# EAGLE design SNES-logo-base (EAGLE 7.2.0)
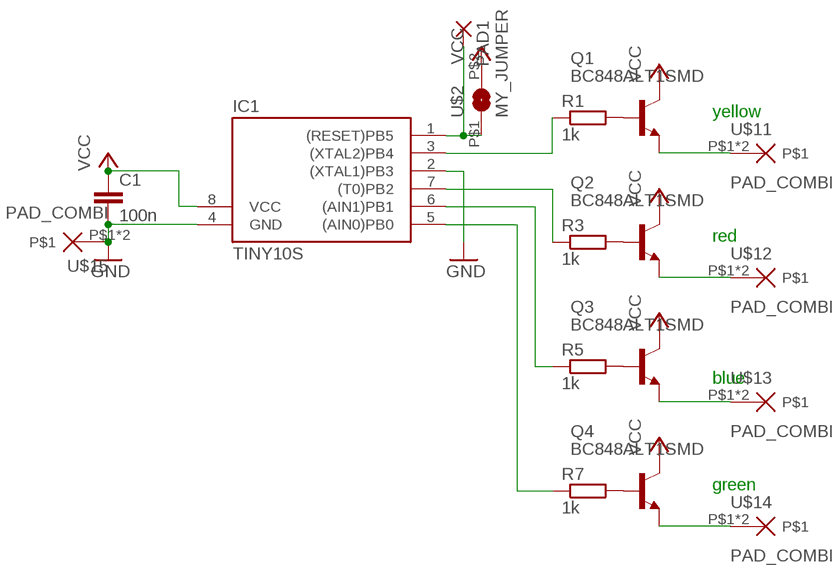
[diagram p0: schematic, sheet 1]

## Parts
C1  100n  C0805  [Z0805]
IC1  TINY10S  [SOIC8]
PAD1  SMD2  [SMD1,27-2,54]
Q1  BC848ALT1SMD  [SOT23]
Q2  BC848ALT1SMD  [SOT23]
Q3  BC848ALT1SMD  [SOT23]
Q4  BC848ALT1SMD  [SOT23]
R1  1k  R0805  [Z0805]
R3  1k  R0805  [Z0805]
R5  1k  R0805  [Z0805]
R7  1k  R0805  [Z0805]
U$2  MY_JUMPER  [MYJUMP]
U$11  PAD_COMBI  [PAD_COMBI]
U$12  PAD_COMBI  [PAD_COMBI]
U$13  PAD_COMBI  [PAD_COMBI]
U$14  PAD_COMBI  [PAD_COMBI]
U$15  PAD_COMBI  [PAD_COMBI]

## Nets
GND: C1.2 IC1.2((XTAL1)PB3) IC1.4(GND) U$15.P$1 U$15.P$2
N$1: Q2.2(E) U$12.P$1 U$12.P$2
N$2: IC1.1((RESET)PB5) PAD1.1(P) U$2.P$1
N$3: Q3.2(E) U$13.P$1 U$13.P$2
N$4: Q1.1(B) R1.2
N$5: Q2.1(B) R3.2
N$6: Q3.1(B) R5.2
N$7: Q4.1(B) R7.2
N$8: Q4.2(E) U$14.P$1 U$14.P$2
N$9: Q1.2(E) U$11.P$1 U$11.P$2
N$12: IC1.3((XTAL2)PB4) R1.1
N$13: IC1.7((T0)PB2) R3.1
N$14: IC1.6((AIN1)PB1) R5.1
N$15: IC1.5((AIN0)PB0) R7.1
VCC: C1.1 IC1.8(VCC) Q1.3(C) Q2.3(C) Q3.3(C) Q4.3(C) U$2.P$2

## Notes on the sheet
- yellow
- red
- blue
- green

## Library data of the parts
C1 = snes_div:C0805
IC1 = atmel:TINY10: MICROCONTROLLER 1 Kbytes ROM; OC_FARNELL: unknown; OC_NEWARK: unknown
PAD1 = wirepad:SMD2: SMD PAD
Q1-Q4 = transistor-npn:BC848*: NPN Transistor
R1 R3 R5 R7 = snes_div:R0805
U$2 = snes_div:MY_JUMPER
U$11-U$15 = MS_Mod:PAD_COMBI

## Board
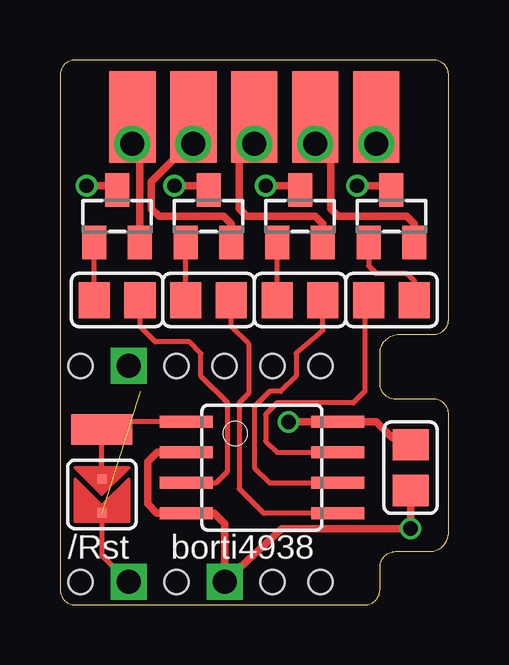
[diagram p1: board, top side]
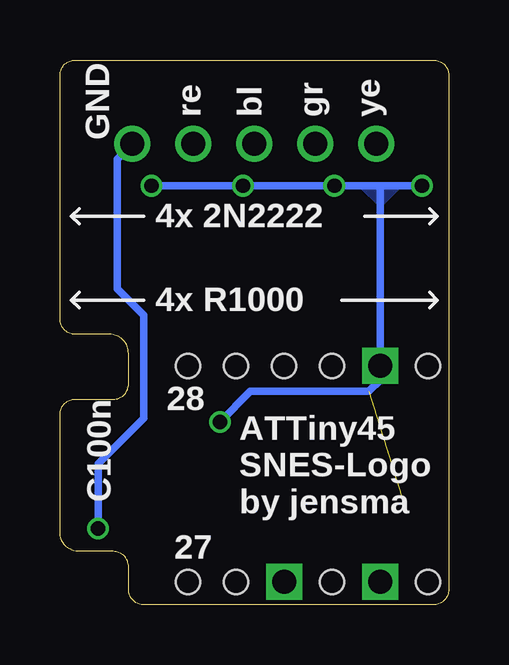
[diagram p2: board, bottom side, seen from below]

Size 16.19 x 22.7 mm. Coordinates in mm from the lower left corner, seen from the top.
Outline: 0.64,0 12.7,0 arc90 13.34,0.64 13.34,1.59 arc-90 13.97,2.22 15.4,2.22 arc90 16.19,3.02 16.19,7.94 arc90 15.56,8.57 13.97,8.57 arc-90 13.34,9.21 13.34,10.48 arc-90 14.13,11.27 15.56,11.27 arc90 16.19,11.91 16.19,22.07 arc90 15.56,22.7 0.64,22.7 arc90 0,22.07 0,0.64 arc90 0.64,0
Copper layers (1*16): Top 0.035mm / dielectric 1.5mm / Bottom 0.035mm
Design rules "ITEADstudio_DRC": minimum track width 6mil, minimum drill 12mil, track to track 6mil, track to pad 6mil, pad to pad 6mil, via to via 6mil, smd to smd 0mil, copper to edge 10mil, drill to drill 10mil, minimum pad ring 10mil, minimum via ring 6mil, stop-mask expansion 2mil, vias tented up to drill 30mil, thermal gap 10mil
Holes 1 mm at 4.86,0.95 0.86,9.95 8.86,0.95 10.86,0.95 6.86,9.95 8.86,9.95 10.86,9.95 0.86,0.95 4.86,9.95

### Footprints (pad centres in the part's own frame; a part is rotated, then mirrored left to right if it is on the bottom)
Z0805 = smd 1.3 x 1.5: 1 -0.95,0; 2 0.95,0
SOIC8 = smd 0.5 x 2.2: 1 -1.905,-3.154; 2 -0.645,-3.154; 3 0.625,-3.154; 4 1.895,-3.154; 5 1.905,3.154; 6 0.635,3.154; 7 -0.635,3.154; 8 -1.905,3.154
SMD1,27-2,54 = smd 1.27 x 2.54: 1 0,0
SOT23 = smd 1 x 1.4: 1 -0.95,-1.1; 2 0.95,-1.1; 3 0,1.1
MYJUMP = smd 0.406 x 0.406: P$1 -0.635,0; P$2 0.765,0
PAD_COMBI = smd 1.93 x 3.81: P$1 0,0 | drill 1: P$2 0,1.111

### Placement (x,y rotation side)
C1  14.61,5.71 270 top
IC1  8.41,5.71 270 top
PAD1  1.75,7.3 270 top
Q1  2.38,16.19 0 top
Q2  13.81,16.19 0 top
Q3  10,16.19 0 top
Q4  6.19,16.19 0 top
R1  2.38,12.7 180 top
R3  13.81,12.7 0 top
R5  10,12.7 180 top
R7  6.19,12.7 180 top
U$2  1.75,4.6 270 top
U$11  3.02,20.32 180 top
U$12  10.64,20.32 180 top
U$13  8.1,20.32 180 top
U$14  5.56,20.32 180 top
U$15  13.18,20.32 180 top

### Tracks (layer width: path | path; a pad name or v marks a point on that pad's centre or on a via)
GND  (via drill 0.6, 1)
  Top 0.203: IC1.4 4.43,3.82 | 5.73,6.35 IC1.2 | U$15.P$1 U$15.P$2
  Top 0.305: 4.43,3.82 4.04,3.82 3.65,4.21 3.65,5.95 4.05,6.35 5.73,6.35 | IC1.4 6.43,3.81 6.86,3.38 v6.86,0.95 9.24,3.17 v14.61,3.17 C1.2
  Bottom 0.305: v14.61,3.17 14.61,5.87 12.7,7.78 12.7,12.06 13.81,13.18 13.81,18.57 U$15.P$2
N$1
  Top 0.305: U$12.P$1 U$12.P$2 11.11,18.73 11.27,18.73 11.27,16.51 11.59,16.19 14.45,16.19 14.76,15.88 Q2.2
N$2
  Top 0.203: IC1.1 2.06,7.62 PAD1.1 U$2.P$1
N$3
  Top 0.305: U$13.P$1 U$13.P$2 7.46,19.21 7.46,16.51 7.78,16.19 10.64,16.19 10.95,15.88 Q3.2
N$4
  Top 0.203: R1.2 Q1.1
N$5
  Top 0.203: Q2.1 12.86,14.13 13.18,13.81 14.45,13.81 14.76,13.49 14.76,12.38 R3.2
N$6
  Top 0.203: R5.2 Q3.1
N$7
  Top 0.203: R7.2 Q4.1
N$8
  Top 0.305: U$14.P$1 U$14.P$2 5.08,18.89 3.81,17.62 3.81,16.51 4.13,16.19 6.83,16.19 7.14,15.88 Q4.2
N$9
  Top 0.305: U$11.P$1 U$11.P$2 3.33,18.89 Q1.2
N$12
  Top 0.203: IC1.3 6.52,5.09 6.99,5.56 6.99,8.41 5.87,9.53 5.87,10.48 5.4,10.95 3.97,10.95 3.33,11.59 3.33,12.38 R1.1 | 3.02,12.07 R1.1 | R1.1
N$13
  Top 0.203: IC1.7 9.05,6.35 8.57,6.83 8.57,7.94 9.05,8.41 12.22,8.41 12.7,8.89 12.7,12.22 R3.1
N$14
  Top 0.203: IC1.6 8.73,5.08 8.1,5.71 8.1,8.26 8.73,8.89 9.21,8.89 9.84,9.53 9.84,10.48 10.95,11.43 10.95,12.38 R5.1
N$15
  Top 0.203: IC1.5 8.49,3.81 7.46,4.84 7.46,8.41 7.86,8.81 7.86,10.87 7.14,11.59 7.14,12.38 R7.1 7.06,12.31
VCC  (via drill 0.6, 1)  (1 unrouted)
  Top 0.203: 2.21,17.46 Q1.3 | 13.64,17.46 Q2.3 | Q3.3 10,17.46 | Q4.3 6.19,17.46 | U$2.P$2 1.75,2.06 v2.86,0.95
  Top 0.305: 14.6,6.99 C1.1 13.81,6.98 13.18,7.62 IC1.8 v9.53,7.62 | v12.38,17.46 13.98,17.46 Q2.3 | v8.57,17.46 10.17,17.46 Q3.3 | v4.76,17.46 6.36,17.46 Q4.3 | Q1.3 2.38,17.3 2.54,17.46 v1.11,17.46
  Bottom 0.305: 2.86,17.46 v1.11,17.46 | 2.86,17.46 v4.76,17.46 v8.57,17.46 v12.38,17.46 | 2.86,17.46 v2.86,9.95 2.86,9.37 3.33,8.89 8.26,8.89 v9.53,7.62
  pour Bottom: 2.86,16.67 3.65,17.46 2.06,17.46

### Text on the board
tNames: /Rst | borti4938
bNames: ye | gr | bl | re | GND | 4x 2N2222 | 4x R1000 | C100n | 28 | ATTiny45 / SNES-Logo / by jensma | 27